# EAGLE design CCR3 (EAGLE 7.1.0)
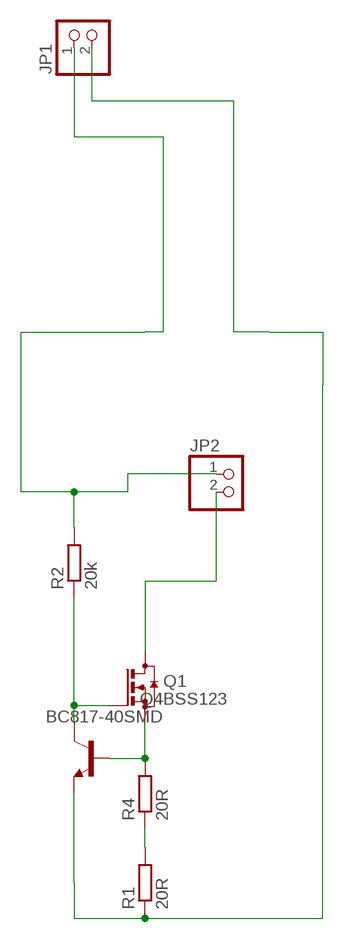
[diagram p0: schematic, sheet 1]

## Parts
JP1  PINHD-1X2  [1X02]
JP2  PINHD-1X2  [1X02]
Q1  BSS123  [SOT23]
Q4  BC817-40SMD  [SOT23-BEC]
R1  20R  R-EU_R1206  [R1206]
R2  20k  R-EU_R1206  [R1206]
R4  20R  R-EU_R1206  [R1206]

## Nets
GND: JP1.2 Q4.E R1.1
N$1: JP1.1 JP2.1 R2.2
N$3: Q1.2(S) Q4.B R4.2
N$4: JP2.2 Q1.3(D)
N$8: Q1.1(G) Q4.C R2.1
N$10: R1.2 R4.1

## Library data of the parts
JP1 JP2 = pinhead:PINHD-1X2: PIN HEADER
Q1 = transistor-small-signal:BSS123: N-CHANNEL MOS FET
Q4 = transistor-npn:BC817*: NPN Transistor
R1 R2 R4 = rcl:R-EU_: RESISTOR, European symbol

## Board
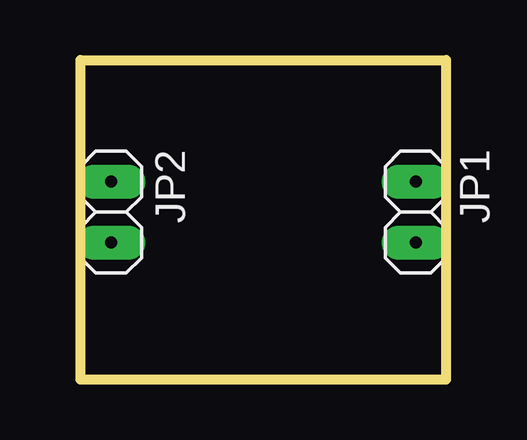
[diagram p1: board, top side]
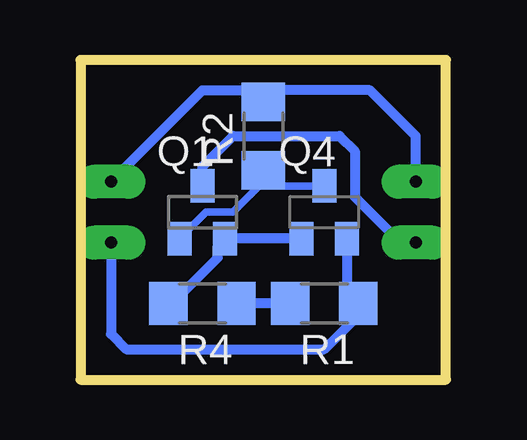
[diagram p2: board, bottom side, seen from below]

Size 15.24 x 13.34 mm. Coordinates in mm from the lower left corner, seen from the top.
Outline: 0,0 0,13.34 15.24,13.34 15.24,0 0,0
Copper layers (1*16): Top 0.035mm / dielectric 1.5mm / Bottom 0.035mm
Design rules "default": minimum track width 10mil, minimum drill 24mil, track to track 8mil, track to pad 8mil, pad to pad 8mil, via to via 8mil, smd to smd 8mil, copper to edge 40mil, drill to drill 8mil, minimum pad ring 10mil, minimum via ring 8mil, stop-mask expansion 4mil, vias tented up to drill 0mil, thermal gap 10mil

### Footprints (pad centres in the part's own frame; a part is rotated, then mirrored left to right if it is on the bottom)
1X02 = drill 0.5 pad 1.422 long: 1 -1.27,0; 2 1.27,0
SOT23 = smd 1 x 1.4: 1 -0.95,-1.1; 2 0.95,-1.1; 3 0,1.1
SOT23-BEC = smd 1 x 1.4: B -0.95,-1.1; C 0,1.1; E 0.95,-1.1
R1206 = smd 1.6 x 1.803: 1 -1.422,0; 2 1.422,0

### Placement (x,y rotation side)
JP1  13.97,6.98 270 top
JP2  1.27,6.98 270 top
Q1  10.16,6.98 0 bottom
Q4  5.08,6.98 0 bottom
R1  5.08,3.18 180 bottom
R2  7.62,10.16 90 bottom
R4  10.16,3.18 180 bottom

### Tracks (layer width: path | path; a pad name or v marks a point on that pad's centre or on a via)
GND
  Bottom 0.406: Q4.E 4.13,3.65 R1.1 3.81,3.02 3.81,2.54 5.08,1.27 13.33,1.27 13.97,1.91 JP1.2
N$1
  Bottom 0.406: JP1.1 11.43,10.8 10.16,12.07 8.1,12.07 R2.2 7.14,12.07 3.18,12.07 1.27,10.16 JP2.1
N$3
  Bottom 0.406: R4.2 11.43,3.18 9.52,5.08 9.52,5.57 Q1.2 Q4.B
N$4
  Bottom 0.406: Q1.3 10.16,8.89 8.89,10.16 4.45,10.16 3.81,9.53 3.81,7.62 1.91,5.71 JP2.2
N$8
  Bottom 0.305: Q4.C 6.97,8.09 R2.1 | 7.62,8.25 8.89,6.98 10.01,6.98 Q1.1
  Bottom 0.406: R2.1 7.62,8.25
N$10
  Bottom 0.406: R1.2 R4.1